# Altium project Dongho.PrjPcb
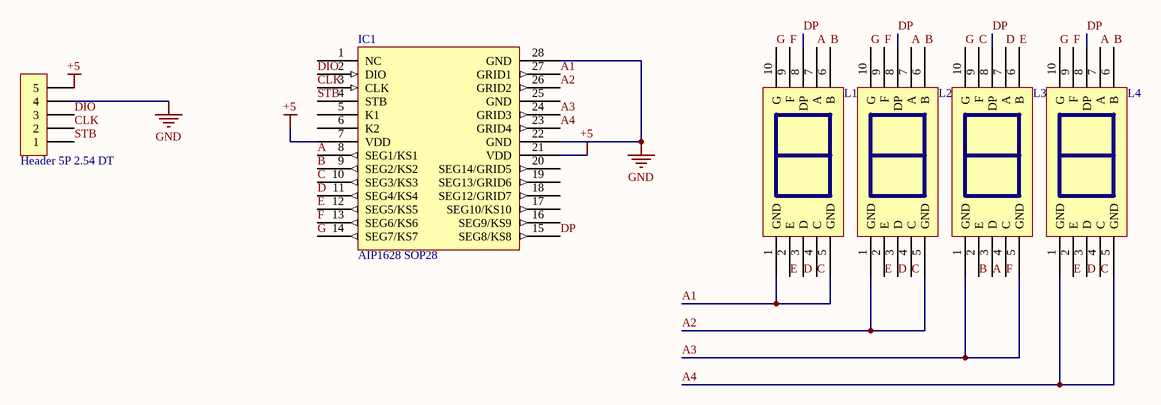
[diagram p0: DongHo.SchDoc]
1 sheet, 6 parts. Net scope: global (net labels, ports and power ports of the same name join across sheets).
Board file: DongHo.PcbDoc

## Sheet DongHo.SchDoc
size A4; SheetNumber: 1; SheetTotal: 1

### Parts
H?  Header 5P 2.54 DT  [XH2.54M-5]
IC1  AIP1628 SOP28  [SOP 28]
L1  LED 7 thanh 2.3 đỏ Anot 48x70mm, 23101BS  [LED 7 THANG 1]  (value not drawn)
L2  LED 7 thanh 2.3 đỏ Anot 48x70mm, 23101BS  [LED 7 THANG 1]  (value not drawn)
L3  LED 7 thanh 2.3 đỏ Anot 48x70mm, 23101BS  [LED 7 THANG 1]  (value not drawn)
L4  LED 7 thanh 2.3 đỏ Anot 48x70mm, 23101BS  [LED 7 THANG 1]  (value not drawn)

### Nets
+5: H?.5 IC1.7(VDD) IC1.21(VDD)
GND: H?.4 IC1.22(GND) IC1.28(GND)
A: IC1.8(SEG1/KS1) L1.7(A) L2.7(A) L3.3(D) L4.7(A)
A1: IC1.27(GRID1) L1.1(GND) L1.5(GND)
A2: IC1.26(GRID2) L2.1(GND) L2.5(GND)
A3: IC1.24(GRID3) L3.1(GND) L3.5(GND)
A4: IC1.23(GRID4) L4.1(GND) L4.5(GND)
B: IC1.9(SEG2/KS2) L1.6(B) L2.6(B) L3.2(E) L4.6(B)
C: IC1.10(SEG3/KS3) L1.4(C) L2.4(C) L3.9(F) L4.4(C)
CLK: H?.2 IC1.3(CLK)
D: IC1.11(SEG4/KS4) L1.3(D) L2.3(D) L3.7(A) L4.3(D)
DIO: H?.3 IC1.2(DIO)
DP: IC1.15(SEG8/KS8) L1.8(DP) L2.8(DP) L3.8(DP) L4.8(DP)
E: IC1.12(SEG5/KS5) L1.2(E) L2.2(E) L3.6(B) L4.2(E)
F: IC1.13(SEG6/KS6) L1.9(F) L2.9(F) L3.4(C) L4.9(F)
G: IC1.14(SEG7/KS7) L1.10(G) L2.10(G) L3.10(G) L4.10(G)
STB: H?.1 IC1.4(STB)

Not connected (* = marked no-connect by the designer): IC1 1(NC) 5(K1) 6(K2) 16(SEG9/KS9) 17(SEG10/KS10) 18(SEG12/GRID7) 19(SEG13/GRID6) 20(SEG14/GRID5) 25(GND)

### Library data of the parts
H? = Header 5P 2.54 DT: Cắm; Ten_Linh_Kien: Header 5P XH2.54-5P Đực Thẳng; Don_Vi: Con; Ma_Hang: MH001298; Chung_Loai: Cắm
IC1 = AIP1628: Dán; Don_Vi: Con; Ten_Linh_Kien: AIP1628; Ghi_Chu: *; Kieu_Chan: SOP28; Chung_Loai: Dán
L1-L4 = LED 7 thanh 2.3 đỏ Anot 48x70mm, 23101BS: Cắm; Don_Vi: Con; Chung_Loai: Dán; Ma_Hang: MH009706; Ten_Linh_Kien: Led 7 0.28 1 Số Anot Sáng Đỏ; Ghi_Chu: *; Kieu_Chan: *